# EasyEDA schematic schematic.json
TITLE: ARDUINO UNO; REV: 1.0; Sheet: 1/1; Drawn By: Arash Saifi
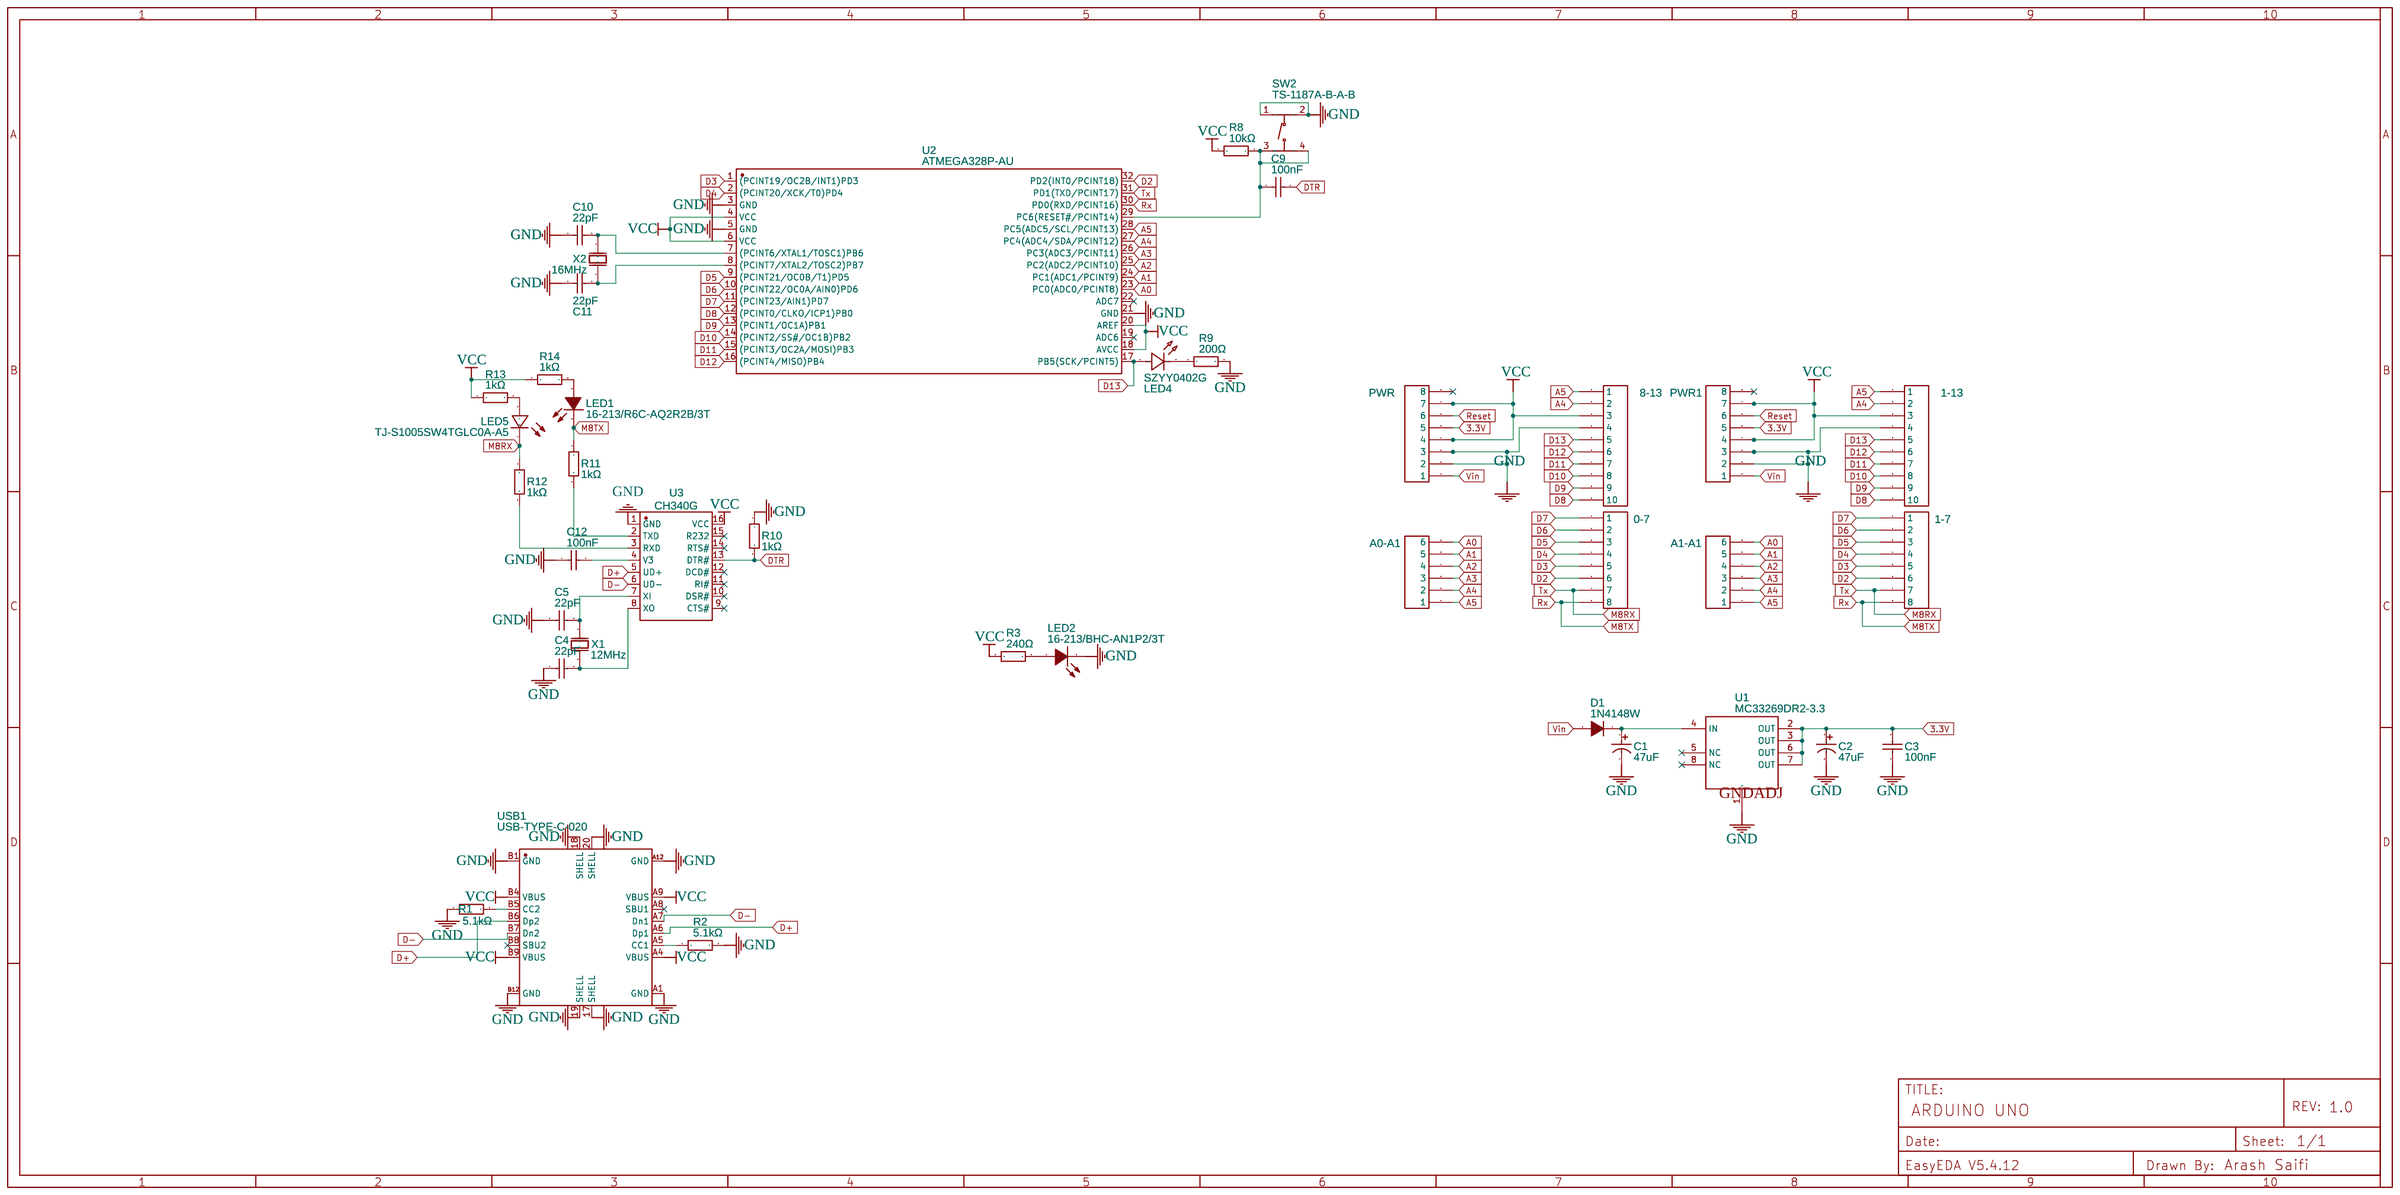
[diagram p0: schematic sheet]

## Parts
0-7  0-7  [HDR-8X1/2.54]
1-7  0-7  [HDR-8X1/2.54]
1-13  8-Aref  [HDR-10X1/2.54]
8-13  8-Aref  [HDR-10X1/2.54]
A0-A1  Analogs  [HDR-6X1/2.54]
A1-A1  Analogs  [HDR-6X1/2.54]
C1  47uF  [CAP-SMD_BD5.0-L5.3-W5.3-LS6.3-FD]
C2  47uF  [CAP-SMD_BD5.0-L5.3-W5.3-LS6.3-FD]
C3  100nF  [C0402]
C4  22pF  [C0402]
C5  22pF  [C0402]
C9  100nF  [C0402]
C10  22pF  [C0402]
C11  22pF  [C0402]
C12  100nF  [C0402]
D1  1N4148W  [SOD-123_L2.8-W1.8-LS3.7-RD]
LED1  16-213/R6C-AQ2R2B/3T  [LED0402-R-RD]
LED2  16-213/BHC-AN1P2/3T  [LED0402-R-RD]
LED4  SZYY0402G  [LED0402-R-RD_GREEN]
LED5  TJ-S1005SW4TGLC0A-A5  [LED0402-RD_ORANGE]
PWR  Powers  [HDR-8X1/2.54]
PWR1  Powers  [HDR-8X1/2.54]
R1  5.1kΩ  [R0402]
R2  5.1kΩ  [R0402]
R3  240Ω  [R0603]
R8  10kΩ  [R0402]
R9  200Ω  [R0402]
R10  1kΩ  [R0402]
R11  1kΩ  [R0402]
R12  1kΩ  [R0402]
R13  1kΩ  [R0402]
R14  1kΩ  [R0402]
SW2  TS-1187A-B-A-B  [SW-SMD_4P-L5.1-W5.1-P3.70-LS6.5-TL-2]
U1  MC33269DR2-3.3  [SOIC-8_L5.0-W4.0-P1.27-LS6.0-BL]
U2  ATMEGA328P-AU  [TQFP-32_L7.0-W7.0-P0.80-LS9.0-BL]
U3  CH340G  [SOIC-16_L9.9-W3.9-P1.27-LS6.0-BL]
USB1  USB-TYPE-C-020  [USB-SMD_USB-TYPE-C-020]
X1  12MHz  [HC-49S_L11.4-W4.8]
X2  16MHz  [CRYSTAL-SMD_L11.4-W4.5-LS12.5]

## Library data of the parts
0-7 1-7 PWR PWR1 = -: Supplier: LCSC; Manufacturer: ReliaPro; Manufacturer Part: Header2.54mm 1*8P; image: http://image.lceda.cn/szlcsc/C49256.jpg
1-13 8-13 = -: Supplier: LCSC; Manufacturer: ReliaPro; Manufacturer Part: Headers  Pins2.54mm1*10P; image: http://image.lceda.cn/szlcsc/C57369.jpg
A0-A1 A1-A1 = -: Supplier: LCSC; Manufacturer: BOOMELE; Manufacturer Part: Header-Male-2.54_1x6; Supplier Part: C37208
C1 C2 = RVE1C470M0505: Contributor: LCSC; Supplier: LCSC; Manufacturer: ROQANG(容强); Supplier Part: C131116; JLCPCB Part Class: Extended Part
C3 C9 C12 = CL05B104KO5NNNC: Supplier: LCSC; Manufacturer: SAMSUNG(三星); Supplier Part: C1525; JLCPCB Part Class: Basic Part
C4 C5 C10 C11 = 0402CG220J500NT: Supplier: LCSC; Manufacturer: FH(风华); Supplier Part: C1555; JLCPCB Part Class: Basic Part
D1 = 1N4148W: Contributor: LCSC; Supplier: LCSC; Manufacturer: HT(金誉); Supplier Part: C179717; JLCPCB Part Class: Extended Part
LED1 = 16-213/R6C-AQ2R2B/3T: Contributor: LCSC; Supplier: LCSC; Supplier Part: C264407; Manufacturer: EVERLIGHT(亿光); JLCPCB Part Class: Extended Part
LED2 = 16-213/BHC-AN1P2/3T: Contributor: LCSC; Supplier: LCSC; Manufacturer: EVERLIGHT(亿光); Supplier Part: C131223; JLCPCB Part Class: Extended Part
LED4 = SZYY0402G: Contributor: LCSC; Supplier: LCSC; Supplier Part: C434446; Manufacturer: yongyu(永裕光电); JLCPCB Part Class: Extended Part
LED5 = TJ-S1005SW4TGLC0A-A5: Contributor: LCSC; Supplier: LCSC; Supplier Part: C273599; Manufacturer: TOGIALED(统佳); JLCPCB Part Class: Extended Part
R1 R2 = 0402WGF5101TCE: Supplier: LCSC; Manufacturer: UNI-ROYAL(厚声); Supplier Part: C25905; JLCPCB Part Class: Basic Part
R3 = RS-03K2400FT: Contributor: LCSC; Supplier: LCSC; Supplier Part: C286579; Manufacturer: FH(风华); JLCPCB Part Class: Extended Part
R8 = 0402WGF1002TCE: Supplier: LCSC; Manufacturer: UNI-ROYAL(厚声); Supplier Part: C25744; JLCPCB Part Class: Basic Part
R9 = 0402WGF2000TCE: Supplier: LCSC; Manufacturer: UNI-ROYAL(厚声); Supplier Part: C25087; JLCPCB Part Class: Basic Part
R10-R14 = 0402WGF1001TCE: Supplier: LCSC; Manufacturer: UNI-ROYAL(厚声); Supplier Part: C11702; JLCPCB Part Class: Basic Part
SW2 = TS-1187A-B-A-B: Contributor: LCSC; Supplier: LCSC; Supplier Part: C318884; Manufacturer: XKB Connectivity(中国星坤); JLCPCB Part Class: Basic Part
U1 = MC33269DR2-3.3: Supplier: LCSC; Manufacturer: onsemi(安森美); Manufacturer Part: MC33269DR2-3.3G; Supplier Part: C7301; JLCPCB Part Class: Extended Part
U2 = ATMEGA328P-AU: Supplier: LCSC; Manufacturer: MICROCHIP(美国微芯); Supplier Part: C14877; JLCPCB Part Class: Extended Part
U3 = CH340G: Supplier: LCSC; Manufacturer: WCH(南京沁恒); Supplier Part: C14267; JLCPCB Part Class: Extended Part
USB1 = USB-TYPE-C-020: Supplier: LCSC; Supplier Part: C2927040; Manufacturer: DEALON(德艺隆); Contributor: lcsc
X1 = X49SM12MSB2SC: Contributor: LCSC; Supplier: LCSC; Supplier Part: C110563; Manufacturer: YXC(扬兴晶振); JLCPCB Part Class: Extended Part
X2 = 49MD-16.000-20-20-20/A: Contributor: LCSC; Supplier: LCSC; Supplier Part: C240963; Manufacturer: LIMING(利明); JLCPCB Part Class: Extended Part

## Nets
3.3V: C2.1 C3.1 PWR.5 PWR1.5 U1.2(OUT) U1.3(OUT) U1.6(OUT) U1.7(OUT)
GND: 1-13.4 8-13.4 C1.2 C2.2 C3.2 C4.1 C5.1 C10.1 C11.1 C12.1 LED2.2(K) PWR.2 PWR.3 PWR1.2 PWR1.3 R1.1 R2.2 R9.2 R10.1 SW2.1(A) SW2.2(B) U1.1(GNDADJ) U2.3(GND) U2.5(GND) U2.21(GND) U3.1(GND) USB1.17(SHELL) USB1.18(SHELL) USB1.19(SHELL) USB1.20(SHELL) USB1.A1(GND) USB1.A12(GND) USB1.B1(GND) USB1.B12(GND)
VCC: 1-13.3 8-13.3 PWR.4 PWR.7 PWR1.4 PWR1.7 R3.1 R8.1 R13.1 R14.1 U2.4(VCC) U2.6(VCC) U2.18(AVCC) U2.20(AREF) U3.16(VCC) USB1.A4(VBUS) USB1.A9(VBUS) USB1.B4(VBUS) USB1.B9(VBUS)
Vin: D1.2(A) PWR.1 PWR1.1
A0: A0-A1.6 A1-A1.6 U2.23(PC0(ADC0/PCINT8))
A1: A0-A1.5 A1-A1.5 U2.24(PC1(ADC1/PCINT9))
A2: A0-A1.4 A1-A1.4 U2.25(PC2(ADC2/PCINT10))
A3: A0-A1.3 A1-A1.3 U2.26(PC3(ADC3/PCINT11))
A4: 1-13.2 8-13.2 A0-A1.2 A1-A1.2 U2.27(PC4(ADC4/SDA/PCINT12))
A5: 1-13.1 8-13.1 A0-A1.1 A1-A1.1 U2.28(PC5(ADC5/SCL/PCINT13))
D2: 0-7.6 1-7.6 U2.32(PD2(INT0/PCINT18))
D3: 0-7.5 1-7.5 U2.1((PCINT19/OC2B/INT1)PD3)
D4: 0-7.4 1-7.4 U2.2((PCINT20/XCK/T0)PD4)
D5: 0-7.3 1-7.3 U2.9((PCINT21/OC0B/T1)PD5)
D6: 0-7.2 1-7.2 U2.10((PCINT22/OC0A/AIN0)PD6)
D7: 0-7.1 1-7.1 U2.11((PCINT23/AIN1)PD7)
D8: 1-13.10 8-13.10 U2.12((PCINT0/CLKO/ICP1)PB0)
D9: 1-13.9 8-13.9 U2.13((PCINT1/OC1A)PB1)
D10: 1-13.8 8-13.8 U2.14((PCINT2/SS#/OC1B)PB2)
D11: 1-13.7 8-13.7 U2.15((PCINT3/OC2A/MOSI)PB3)
D12: 1-13.6 8-13.6 U2.16((PCINT4/MISO)PB4)
D13: 1-13.5 8-13.5 LED4.1(A) U2.17(PB5(SCK/PCINT5))
D+: U3.5(UD+) USB1.A6(Dp1) USB1.B6(Dp2)
D-: U3.6(UD-) USB1.A7(Dn1) USB1.B7(Dn2)
DTR: C9.2 R10.2 U3.13(DTR#)
M8RX: 0-7.7 1-7.7 LED5.1(C) R12.1 U2.31(PD1(TXD/PCINT17))
M8TX: 0-7.8 1-7.8 LED1.2(K) R11.1 U2.30(PD0(RXD/PCINT16))
Reset: PWR.6 PWR1.6
Net-(C1-1): C1.1 D1.1(K) U1.4(IN)
Net-(C4-2): C4.2 U3.8(XO) X1.2(OSC2)
Net-(C5-2): C5.2 U3.7(XI) X1.1(OSC1)
Net-(C9-1): C9.1 R8.2 SW2.3(C) SW2.4(D) U2.29(PC6(RESET#/PCINT14))
Net-(C10-2): C10.2 U2.7((PCINT6/XTAL1/TOSC1)PB6) X2.2(OSC2)
Net-(C11-2): C11.2 U2.8((PCINT7/XTAL2/TOSC2)PB7) X2.1(OSC1)
Net-(C12-2): C12.2 U3.4(V3)
Net-(LED1-1): LED1.1(A) R14.2
Net-(LED2-1): LED2.1(A) R3.2
Net-(LED4-2): LED4.2(K) R9.1
Net-(LED5-2): LED5.2(A) R13.2
Net-(R1-2): R1.2 USB1.B5(CC2)
Net-(R2-1): R2.1 USB1.A5(CC1)
Net-(R11-2): R11.2 U3.2(TXD)
Net-(R12-2): R12.2 U3.3(RXD)

Not connected (* = marked no-connect by the designer): PWR 8*; PWR1 8*; U1 5(NC)* 8(NC)*; U2 19(ADC6)* 22(ADC7)*; U3 9(CTS#)* 10(DSR#)* 11(RI#)* 12(DCD#)* 14(RTS#)* 15(R232)*; USB1 A8(SBU1)* B8(SBU2)*
